# Altium schematic sheet Day10F206.SchDoc
size B
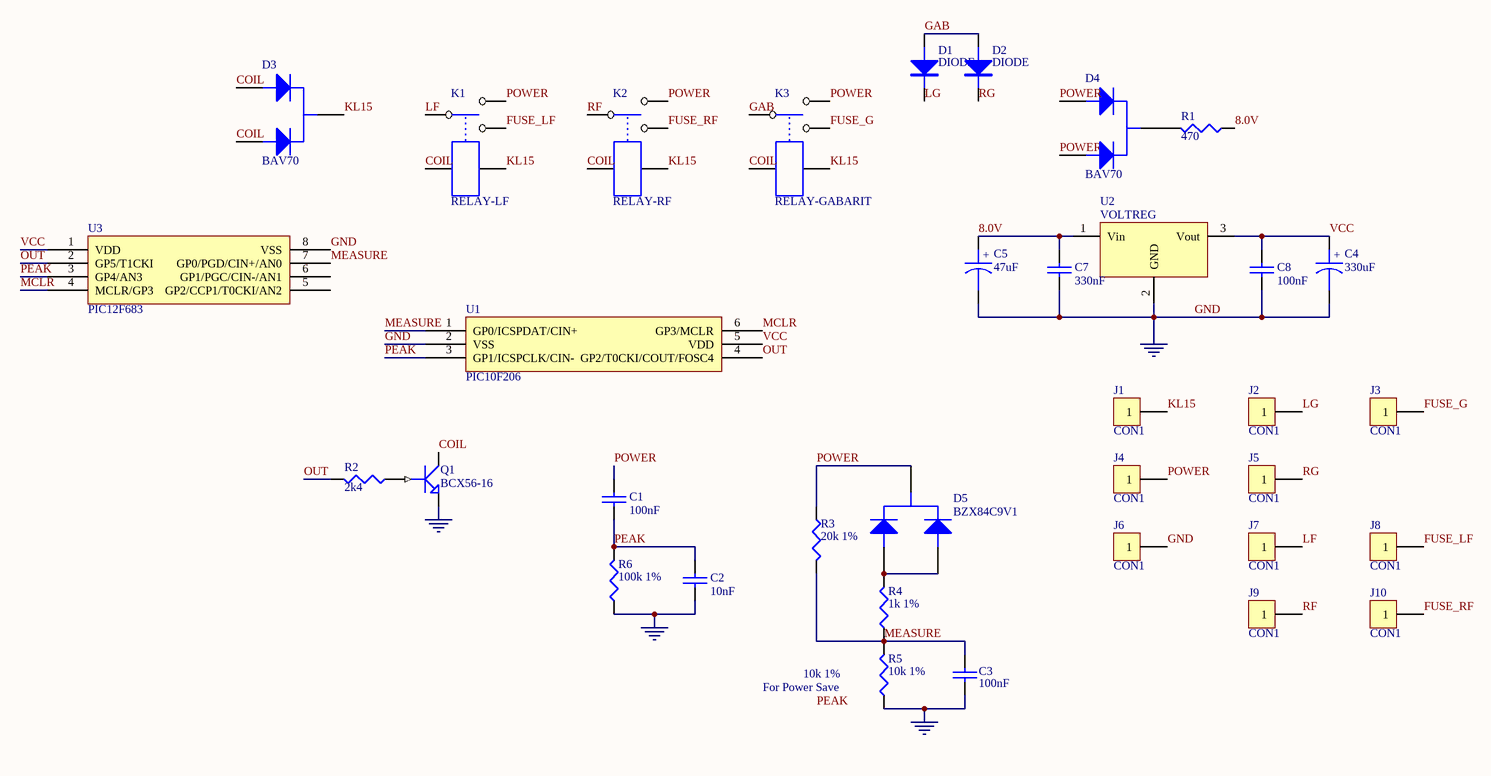
[diagram p0: Day10F206.SchDoc]

## Parts
C1  100nF  [0805]
C2  10nF  [0603]
C3  100nF  [0603]
C4  330uF  [RA 6.3mm]
C5  47uF  [RA 6.3mm]
C7  330nF  [0805]
C8  100nF  [0805]
D1  DIODE  [DIODE0.7 Radial]
D2  DIODE  [DIODE0.7 Radial]
D3  BAV70  [SOT-23]
D4  BAV70  [SOT-23]
D5  BZX84C9V1  [SOT-23]
J1  CON1  [SIP1 - WIRE]
J2  CON1  [SIP1 - WIRE]
J3  CON1  [SIP1 - WIRE]
J4  CON1  [SIP1 - WIRE]
J5  CON1  [SIP1 - WIRE]
J6  CON1  [SIP1 - WIRE]
J7  CON1  [SIP1 - WIRE]
J8  CON1  [SIP1 - WIRE]
J9  CON1  [SIP1 - WIRE]
J10  CON1  [SIP1 - WIRE]
K1  RELAY-LF  [RELAY5PIN]
K2  RELAY-RF  [RELAY5PIN]
K3  RELAY-GABARIT  [RELAY5PIN]
Q1  BCX56-16  [SOT-89]
R1  470  [0805]
R2  2k4  [0603]
R3  20k 1%  [0603]
R4  1k 1%  [0603]
R5  10k 1%  [0603]
R6  100k 1%  [0603]
U1  PIC10F206  [SOT-23 - 6 WIDE]
U2  VOLTREG  [TO-92B]
U3  PIC12F683  [SO-8]

## Nets
GND: C2.2 C3.1 C4.2 C5.2 C7.2 C8.2 J6.1 Q1.3(E) R5.1 R6.1 U1.2(VSS) U2.2(GND) U3.8(VSS)
8.0V: C5.1 C7.1 R1.1 U2.1(Vin)
COIL: D3.1(A1) D3.3(A2) K1.4 K2.4 K3.4 Q1.2(C)
FUSE_G: J3.1 K3.3
FUSE_LF: J8.1 K1.3
FUSE_RF: J10.1 K2.3
GAB: D1.A D2.A K3.1
KL15: D3.2(K) J1.1 K1.5 K2.5 K3.5
LF: J7.1 K1.1
LG: D1.K J2.1
MCLR: U1.6(GP3/MCLR) U3.4(MCLR/GP3)
MEASURE: C3.2 R3.2 R4.1 R5.2 U1.1(GP0/ICSPDAT/CIN+) U3.7(GP0/PGD/CIN+/AN0)
OUT: R2.2 U1.4(GP2/T0CKI/COUT/FOSC4) U3.2(GP5/T1CKI)
PEAK: C1.2 C2.1 R6.2 U1.3(GP1/ICSPCLK/CIN-) U3.3(GP4/AN3)
POWER: C1.1 D4.1(A1) D4.3(A2) D5.2(K) J4.1 K1.2 K2.2 K3.2 R3.1
RF: J9.1 K2.1
RG: D2.K J5.1
VCC: C4.1 C8.1 U1.5(VDD) U2.3(Vout) U3.1(VDD)
NetD4_2: D4.2(K) R1.2
NetD5_1: D5.1(A1) D5.3(A2) R4.2
NetQ1_1: Q1.1(B) R2.1

Not connected (* = marked no-connect by the designer): U3 5(GP2/CCP1/T0CKI/AN2) 6(GP1/PGC/CIN-/AN1)

## Notes on the sheet
- (near R5) For Power Save
- 10k 1%
- Labels drawn without touching a wire or pin: PEAK
- (in symbol CAPACITOR POL) +

## Library data of the parts
C1-C3 C7 C8 = CAP: Capacitor
C4 C5 = CAPACITOR POL: Capacitor
D3-D5 = DUAL DIODE BAV70
J1-J10 = CON1: Connector
K1-K3 = RELAY-SPDT
Q1 = NPN1: NPN Transistor
R1-R6 = RES1